# EAGLE design BadgeHighSchoolFirst2 (EAGLE 9.5.0)
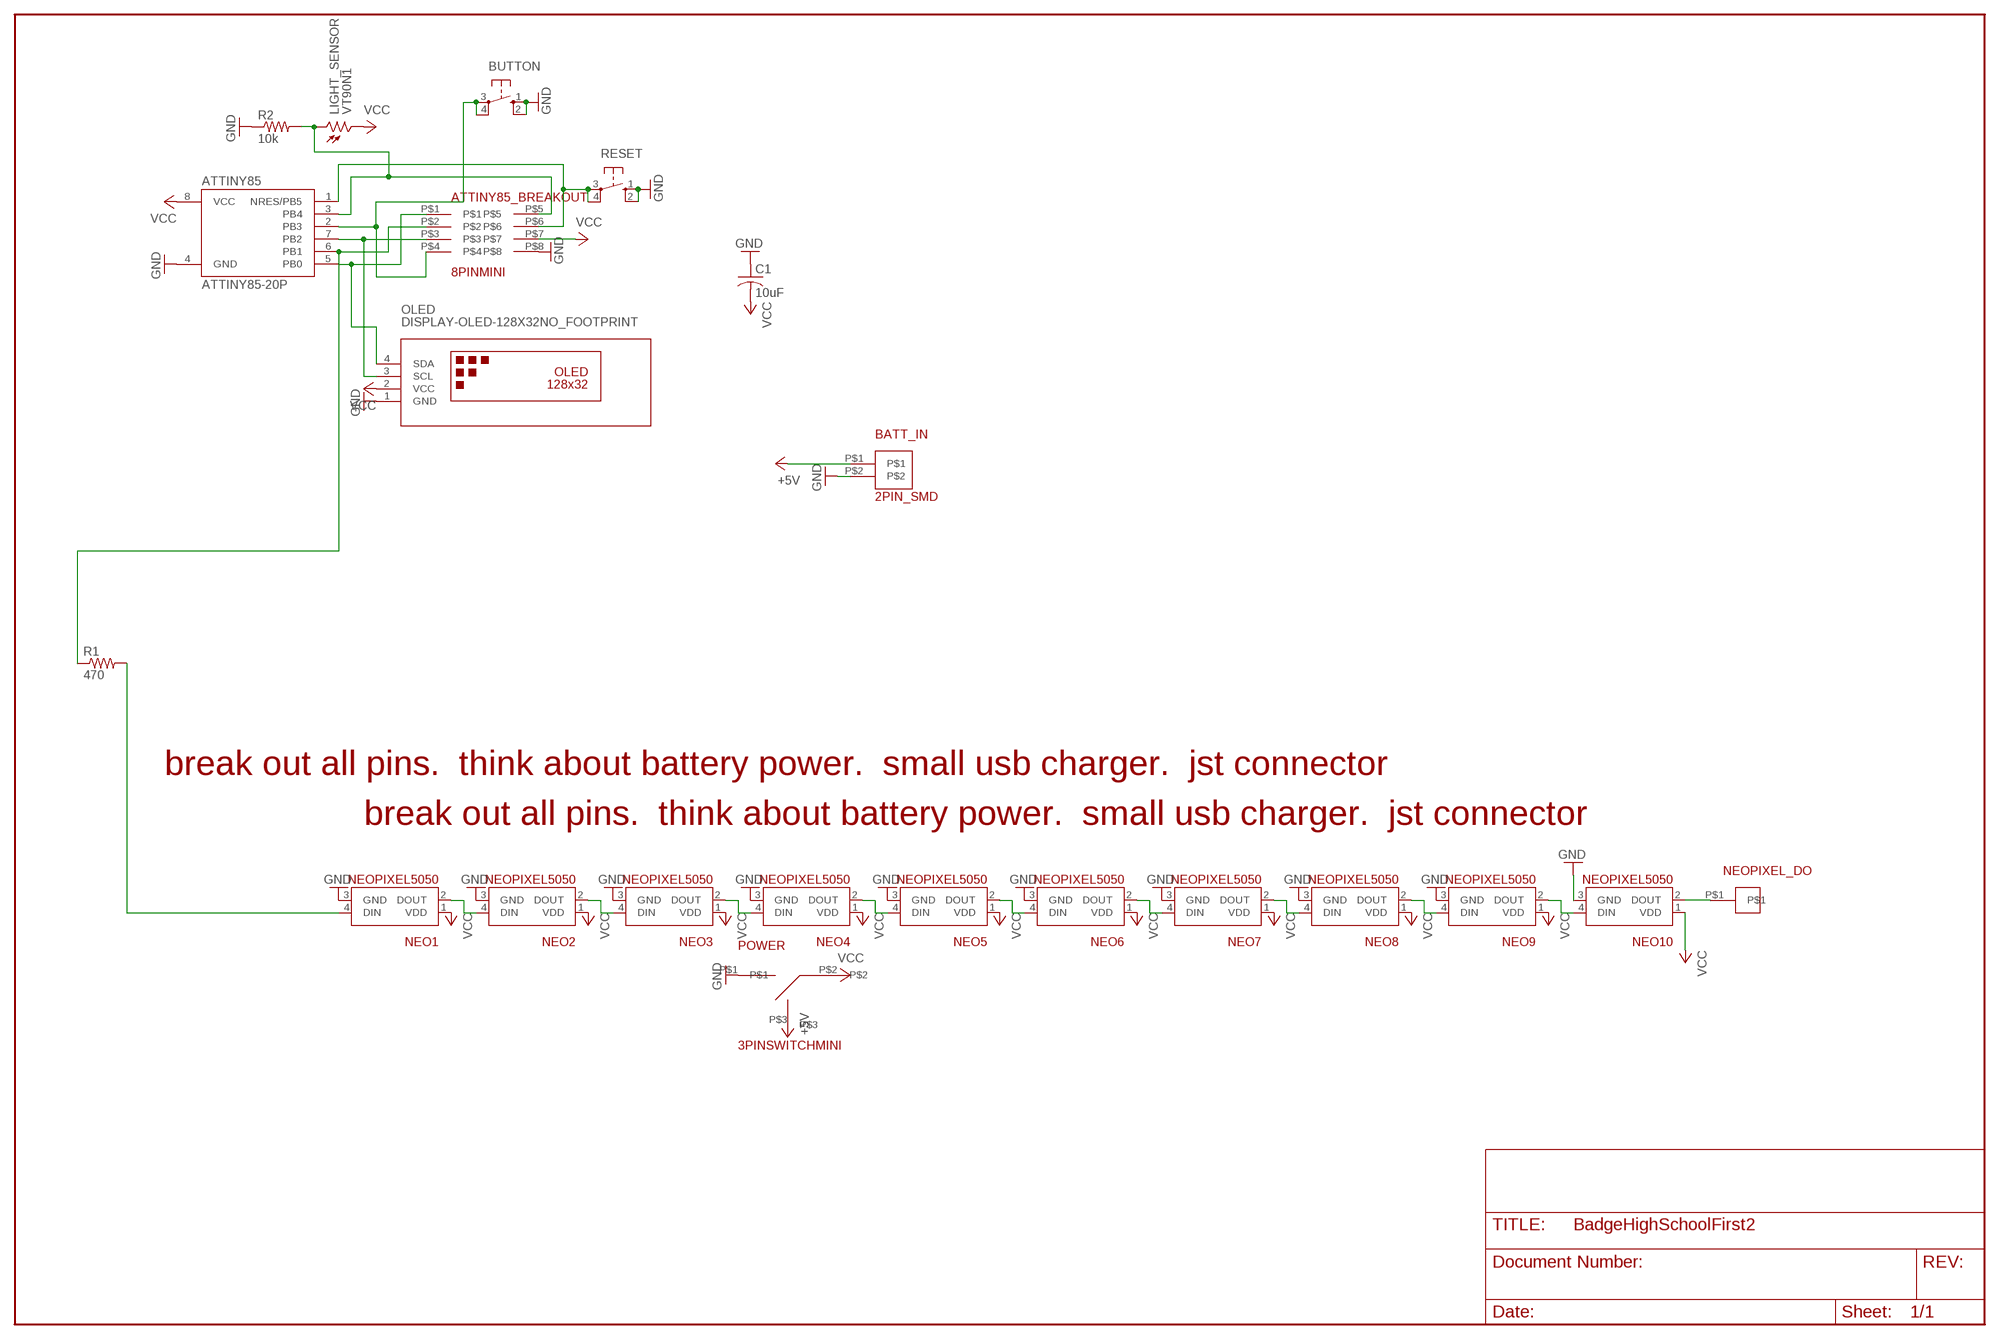
[diagram p0: schematic, sheet 1]

## Parts
ATTINY85  ATTINY85-20P  [PDIP08_300MIL]
ATTINY85_BREAKOUT  8PINMINI  [8PINMINI]
BATT_IN  2PIN_SMD  [2PIN_SMD]
BUTTON  10-XX  [B3F-10XX]
C1  10uF  C-US025-024X044  [C025-024X044]
LIGHT_SENSOR  VT90N1  [VT900]
NEO1  NEOPIXEL5050  [NEOPIXEL5050]
NEO2  NEOPIXEL5050  [NEOPIXEL5050]
NEO3  NEOPIXEL5050  [NEOPIXEL5050]
NEO4  NEOPIXEL5050  [NEOPIXEL5050]
NEO5  NEOPIXEL5050  [NEOPIXEL5050]
NEO6  NEOPIXEL5050  [NEOPIXEL5050]
NEO7  NEOPIXEL5050  [NEOPIXEL5050]
NEO8  NEOPIXEL5050  [NEOPIXEL5050]
NEO9  NEOPIXEL5050  [NEOPIXEL5050]
NEO10  NEOPIXEL5050  [NEOPIXEL5050]
NEOPIXEL_DO  1PINMINI  [1PINMINI]
OLED  DISPLAY-OLED-128X32NO_FOOTPRINT  [DISPLAY-OLED-128X32_NO_FOOTPRINT]
POWER  3PINSWITCHMINI  [3PINMINI]
R1  470  R-US_0204/5  [0204/5]
R2  10k  R-US_0204/5  [0204/5]
RESET  10-XX  [B3F-10XX]

## Nets
+5V [5V]: BATT_IN.P$1 POWER.P$3
GND [5V]: ATTINY85.4(GND) ATTINY85_BREAKOUT.P$8 BATT_IN.P$2 BUTTON.1(S) BUTTON.2(S1) C1.1 NEO1.3(GND) NEO2.3(GND) NEO3.3(GND) NEO4.3(GND) NEO5.3(GND) NEO6.3(GND) NEO7.3(GND) NEO8.3(GND) NEO9.3(GND) NEO10.3(GND) OLED.1(GND) POWER.P$1 R2.1 RESET.1(S) RESET.2(S1)
N$11: ATTINY85.5(PB0) ATTINY85_BREAKOUT.P$1 OLED.4(SDA)
N$12: NEO1.4(DIN) R1.2
N$13: ATTINY85.7(PB2) ATTINY85_BREAKOUT.P$3 OLED.3(SCL)
N$14: ATTINY85.2(PB3) ATTINY85_BREAKOUT.P$4 BUTTON.3(P) BUTTON.4(P1)
N$15: ATTINY85.3(PB4) ATTINY85_BREAKOUT.P$5 LIGHT_SENSOR.1 R2.2
N$16: ATTINY85.1(NRES/PB5) ATTINY85_BREAKOUT.P$6 RESET.3(P) RESET.4(P1)
N$18: NEO1.2(DOUT) NEO2.4(DIN)
N$19: ATTINY85.6(PB1) ATTINY85_BREAKOUT.P$2 R1.1
N$20: NEO2.2(DOUT) NEO3.4(DIN)
N$21: NEO3.2(DOUT) NEO4.4(DIN)
N$22: NEO4.2(DOUT) NEO5.4(DIN)
N$23: NEO5.2(DOUT) NEO6.4(DIN)
N$24: NEO6.2(DOUT) NEO7.4(DIN)
N$25: NEO7.2(DOUT) NEO8.4(DIN)
N$26: NEO8.2(DOUT) NEO9.4(DIN)
N$27: NEO9.2(DOUT) NEO10.4(DIN)
N$28: NEO10.2(DOUT) NEOPIXEL_DO.P$1
VCC [5V]: ATTINY85.8(VCC) ATTINY85_BREAKOUT.P$7 C1.2 LIGHT_SENSOR.2 NEO1.1(VDD) NEO2.1(VDD) NEO3.1(VDD) NEO4.1(VDD) NEO5.1(VDD) NEO6.1(VDD) NEO7.1(VDD) NEO8.1(VDD) NEO9.1(VDD) NEO10.1(VDD) OLED.2(VCC) POWER.P$2

## Notes on the sheet
- break out all pins.  think about battery power.  small usb charger.  jst connector
- break out all pins.  think about battery power.  small usb charger.  jst connector

## Library data of the parts
ATTINY85 = TrophyParts:ATTINY85*: ATMEL ATtiny 85 Packages: P = PDIP 08 30mil S = SOIC 08 EIAJ 208mil Technologies Note: for complete ordering code (temp. range, finish, tape&reel etc.) see www.atmel.com • Supply Voltage: V = (1.8…5.5)V | [blank] = (2.7…5.5)V • Speed: 10 = 10 MHz | 20 = 20 MHz Author: Dipl.-Ing. FH Rainer Bayer HHN Hochschule Heilbronn (Heilbronn University), rainer.bayer@hs-heilbronn.de Ingenieurbüro ing-rb, mail@ing-rb.de
ATTINY85_BREAKOUT = TrophyParts:8PINMINI
BATT_IN = TrophyParts:2PIN_SMD
BUTTON RESET = switch-omron:10-XX: OMRON SWITCH; MPN: B3F-1000; OC_FARNELL: 176432; OC_NEWARK: 36M3542
C1 = adafruit:C-US: CAPACITOR, American symbol
LIGHT_SENSOR = TrophyParts:VT9: Photoconductive Cell VT900 Series Source: http://optoelectronics.perkinelmer.com/content/Datasheets/DTS_vt900seriesdatasheet.pdf
NEO1-NEO10 = TrophyParts:NEOPIXEL5050
NEOPIXEL_DO = TrophyParts:1PINMINI
OLED = TrophyParts:DISPLAY-OLED-128X32: 128x32 Dot Matrix OLED Module with I2C interface based on SSD1306 chip More details available here: http://www.tinyosshop.com/index.php?route=product/product&product_id=953 Schematic available here: http://www.tinyosshop.com/datasheet/OLED%2012832.pdf SSD1306 datasheet: https://cdn-shop.adafruit.com/datasheets/SSD1306.pdf Click here to find device on ebay.com <http://www.ebay.com/sch/oled+display+128x32+i2c>
POWER = TrophyParts:3PINSWITCHMINI
R1 R2 = adafruit:R-US_: RESISTOR, American symbol

## Net classes
2 5V: width 0.508 mm
3 BAT: width 0.508 mm

## Board
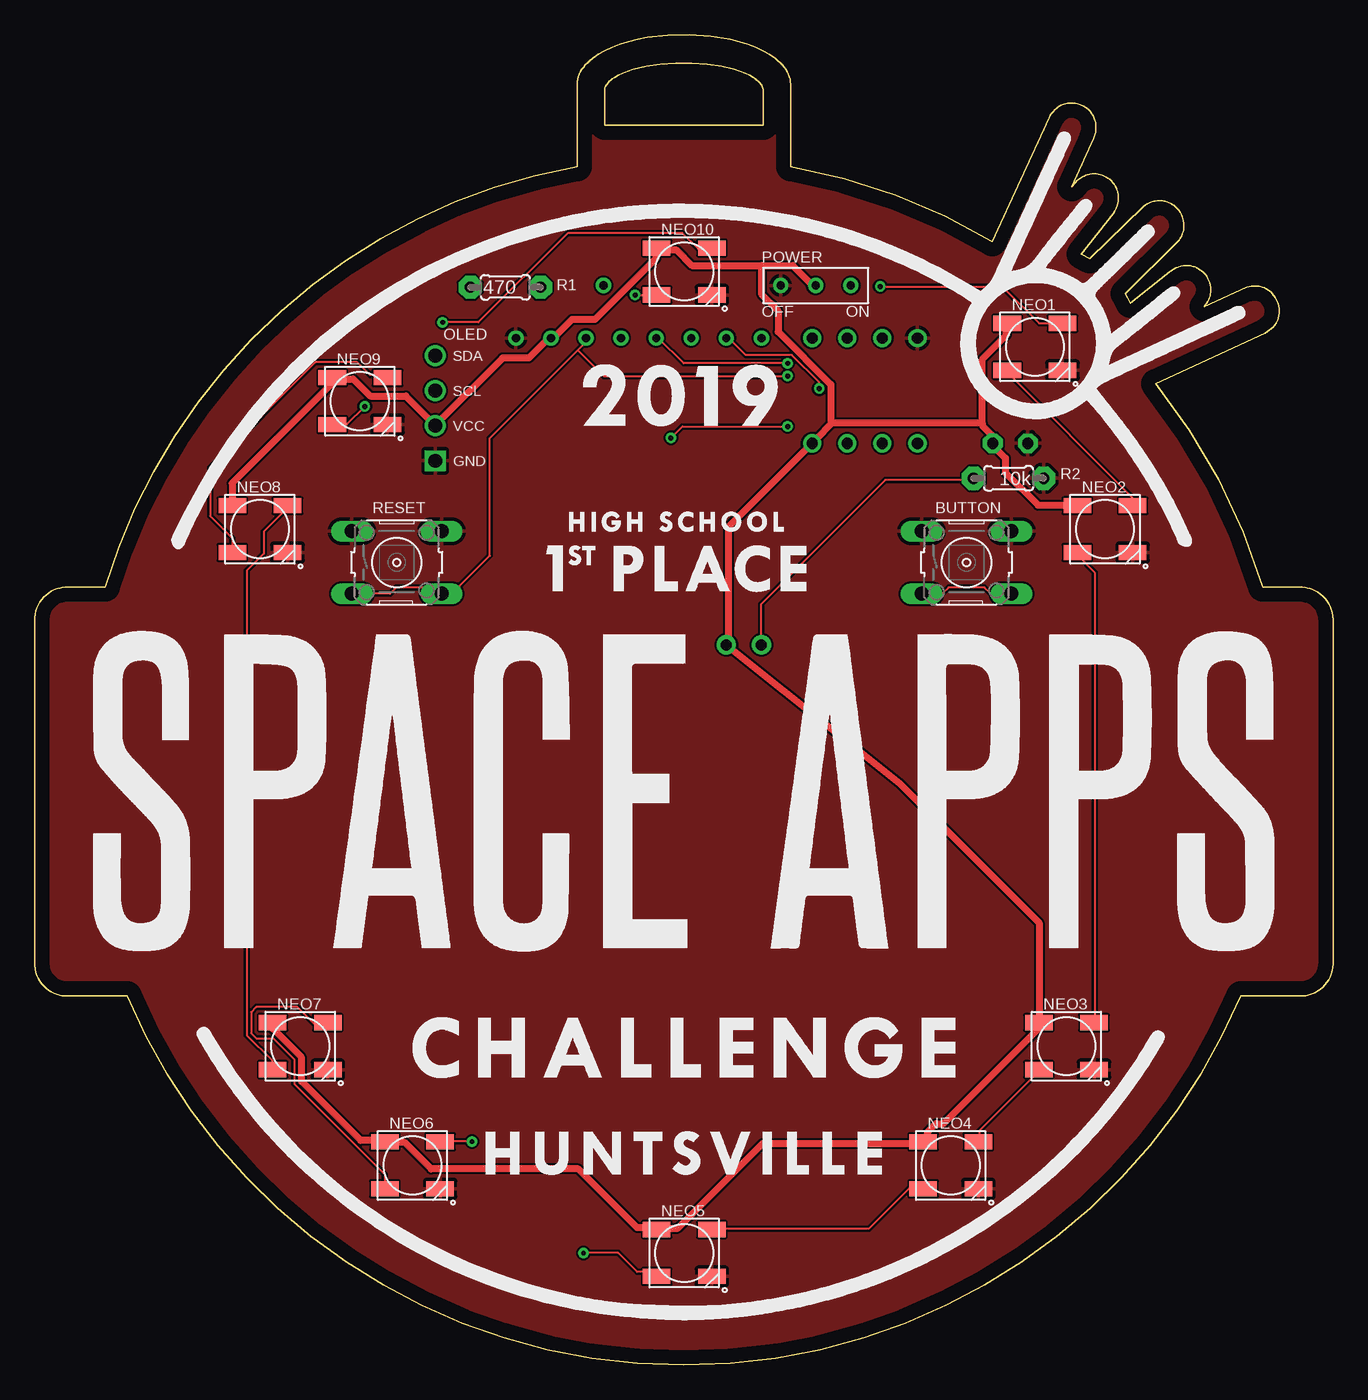
[diagram p1: board, top side]
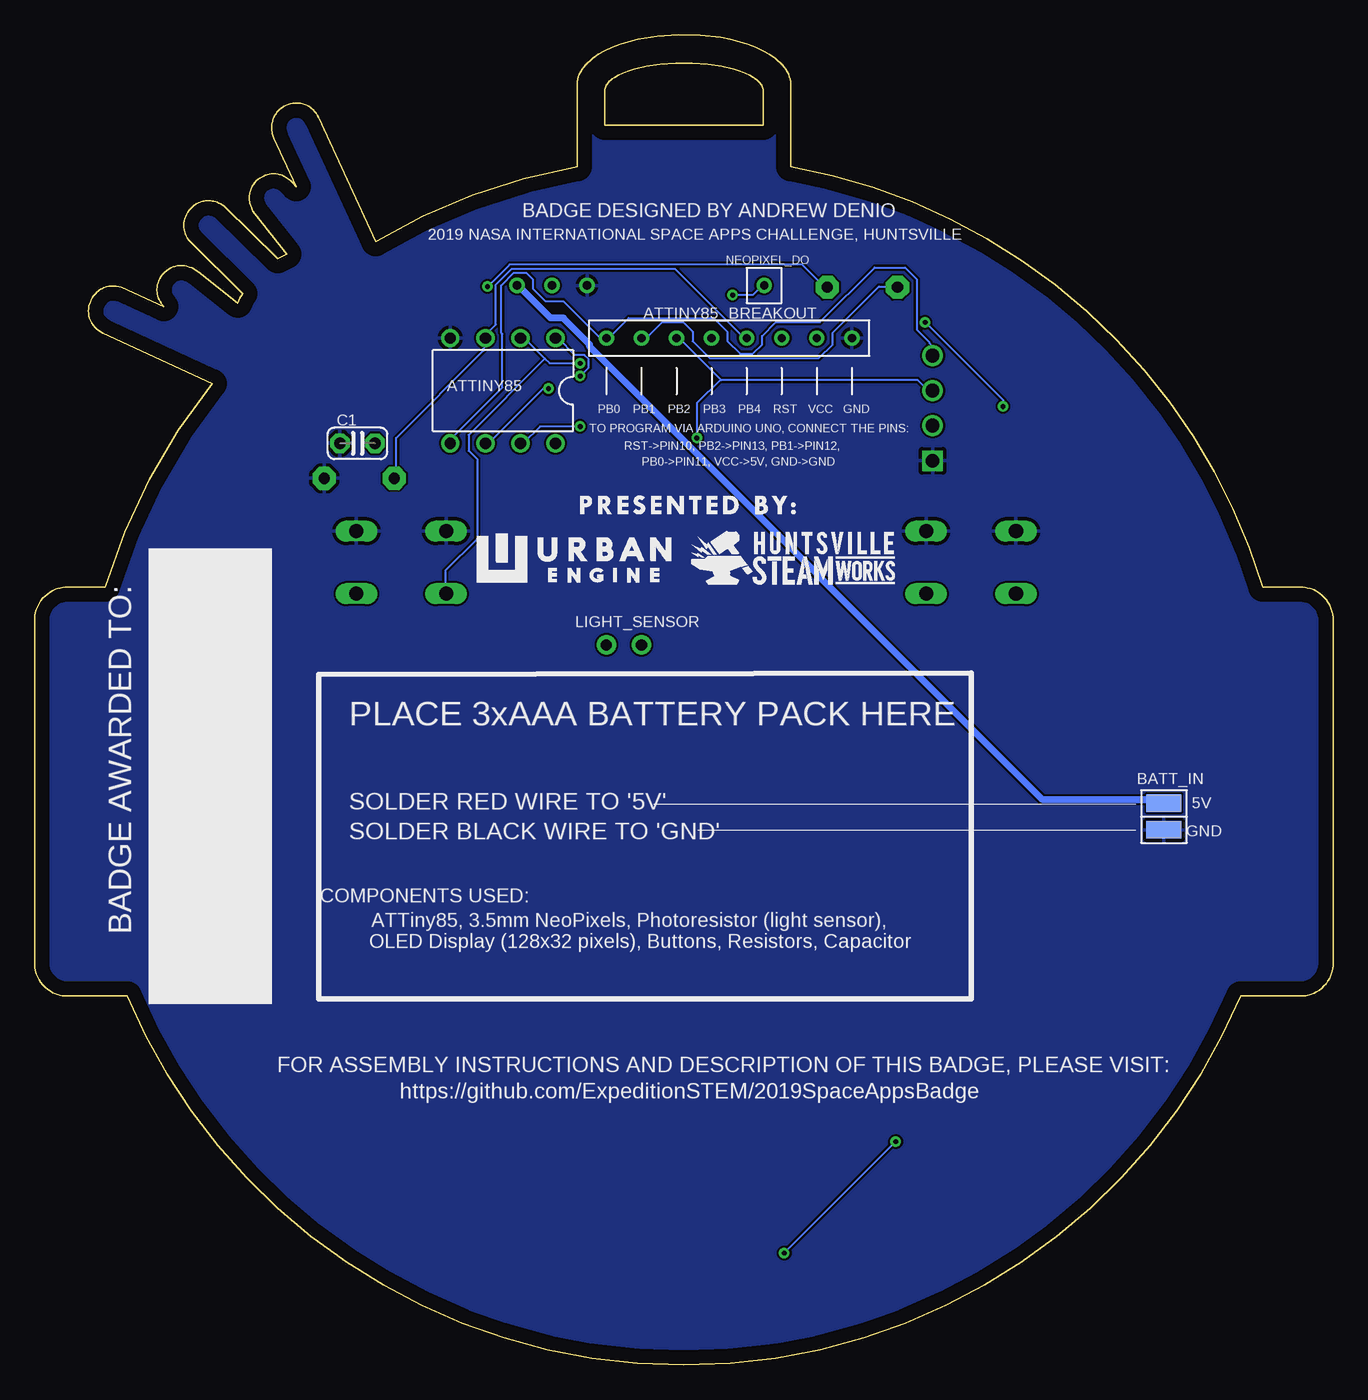
[diagram p2: board, bottom side, seen from below]

Size 94.08 x 96.41 mm. Coordinates in mm from the lower left corner, seen from the top.
Outline: 91.72,56.37 88.95,56.37 87.54,60.35 85.77,64.15 83.65,67.74 81.21,71.09 89.13,74.78 89.3,74.87 89.46,74.97 89.6,75.09 89.72,75.21 89.83,75.35 89.93,75.49 90.01,75.64 90.04,75.71 90.1,75.87 90.14,76.04 90.16,76.2 90.17,76.37 90.16,76.55 90.13,76.72 90.08,76.89 90.02,77.07 89.95,77.21 89.88,77.33 89.81,77.44 89.74,77.54 89.65,77.63 89.57,77.72 89.47,77.8 89.38,77.88 89.27,77.94 89.17,78 89.06,78.05 88.94,78.1 88.83,78.13 88.71,78.16 88.59,78.17 88.46,78.18 88.33,78.18 88.15,78.17 87.97,78.14 87.79,78.09 84.72,76.68 84.82,76.8 84.91,76.93 84.98,77.06 85.05,77.19 85.11,77.32 85.15,77.46 85.18,77.59 85.2,77.74 85.21,77.82 85.21,77.99 85.2,78.08 85.17,78.25 85.13,78.41 85.07,78.57 84.99,78.73 84.89,78.88 84.78,79.03 84.65,79.17 84.5,79.3 84.35,79.41 84.18,79.5 84.1,79.54 84.01,79.58 83.92,79.6 83.83,79.63 83.74,79.65 83.65,79.66 83.55,79.67 83.46,79.67 83.37,79.67 83.2,79.65 83.03,79.62 82.86,79.57 82.69,79.5 82.52,79.41 82.35,79.31 82.18,79.19 79.37,76.93 79.2,77.29 79.01,77.64 82.81,81.38 82.91,81.52 83.01,81.66 83.09,81.81 83.15,81.96 83.2,82.11 83.24,82.27 83.26,82.43 83.26,82.59 83.25,82.75 83.23,82.91 83.19,83.06 83.13,83.22 83.06,83.37 82.97,83.52 82.87,83.67 82.81,83.75 82.74,83.83 82.67,83.9 82.59,83.97 82.51,84.03 82.43,84.08 82.35,84.14 82.26,84.18 82.17,84.23 82.08,84.26 81.98,84.29 81.89,84.32 81.79,84.34 81.69,84.36 81.59,84.36 81.43,84.37 81.31,84.36 81.19,84.34 81.08,84.32 80.96,84.28 80.84,84.24 80.73,84.19 80.61,84.14 80.44,84.03 80.31,83.93 76.45,80.17 75.81,80.49 78.13,83.41 78.25,83.61 78.35,83.81 78.43,84.01 78.48,84.2 78.5,84.3 78.51,84.39 78.52,84.49 78.52,84.58 78.51,84.76 78.5,84.84 78.48,84.93 78.46,85.01 78.41,85.18 78.38,85.25 78.3,85.41 78.21,85.55 78.11,85.68 78,85.8 77.88,85.91 77.75,86 77.62,86.09 77.49,86.16 77.35,86.21 77.21,86.26 77.06,86.29 76.92,86.31 76.77,86.32 76.61,86.31 76.43,86.28 76.34,86.26 76.24,86.23 76.14,86.2 76.04,86.16 75.94,86.1 75.83,86.04 75.73,85.97 75.62,85.89 75.51,85.8 75.4,85.7 75.3,85.59 75.19,85.46 75.19,85.46 75.12,85.38 76.74,88.9 76.81,89.12 76.84,89.23 76.86,89.35 76.88,89.46 76.88,89.57 76.89,89.68 76.88,89.79 76.87,89.9 76.86,90.01 76.84,90.11 76.81,90.22 76.77,90.32 76.73,90.42 76.68,90.52 76.63,90.6 76.58,90.69 76.52,90.77 76.46,90.84 76.39,90.91 76.32,90.98 76.25,91.04 76.17,91.1 76.09,91.16 76.01,91.21 75.92,91.25 75.83,91.3 75.74,91.33 75.64,91.36 75.55,91.39 75.38,91.42 75.21,91.44 75.12,91.44 75,91.44 74.9,91.43 74.79,91.41 74.68,91.39 74.57,91.36 74.46,91.32 74.34,91.27 74.23,91.21 74.12,91.13 74,91.05 73.89,90.95 73.79,90.83 73.68,90.7 73.58,90.56 73.49,90.39 69.36,81.4 65.95,83.23 62.37,84.76 58.64,85.96 54.76,86.84 54.76,92.81 54.75,92.99 54.73,93.17 54.68,93.36 54.61,93.53 54.52,93.71 54.42,93.88 54.3,94.05 54.16,94.21 54,94.37 53.83,94.53 53.65,94.68 53.23,94.96 52.76,95.23 52.23,95.48 51.66,95.7 51.04,95.89 50.39,96.06 48.97,96.3 47.43,96.41 45.86,96.37 44.38,96.2 43.68,96.06 43.02,95.89 42.41,95.7 41.84,95.48 41.31,95.23 40.84,94.96 40.42,94.68 40.23,94.53 40.06,94.37 39.91,94.21 39.77,94.05 39.65,93.88 39.55,93.71 39.46,93.53 39.39,93.36 39.34,93.17 39.31,92.99 39.3,92.81 39.3,86.83 36.28,86.18 33.34,85.33 30.49,84.28 27.74,83.04 25.09,81.62 22.56,80.03 20.14,78.28 17.86,76.36 15.71,74.3 13.7,72.1 11.84,69.77 10.15,67.31 8.62,64.73 7.27,62.04 6.1,59.25 5.12,56.37 2.22,56.36 1.98,56.34 1.87,56.32 1.64,56.26 1.43,56.17 1.22,56.07 1.03,55.95 0.85,55.8 0.68,55.64 0.53,55.47 0.39,55.28 0.27,55.08 0.17,54.86 0.09,54.64 0.04,54.4 0,54.15 0,28.94 0.04,28.7 0.09,28.46 0.17,28.24 0.27,28.02 0.39,27.82 0.53,27.63 0.68,27.46 0.85,27.3 1.03,27.15 1.22,27.03 1.43,26.93 1.53,26.88 1.75,26.81 1.87,26.78 1.98,26.76 2.22,26.74 6.71,26.73 8.06,23.84 9.61,21.07 11.35,18.43 13.27,15.93 15.36,13.57 17.61,11.37 20.02,9.34 22.57,7.48 25.25,5.8 28.06,4.32 30.99,3.04 34.02,1.97 37.15,1.12 40.37,0.5 43.67,0.13 47.04,0 50.41,0.13 53.7,0.5 56.92,1.12 60.05,1.97 63.09,3.04 66.01,4.32 68.82,5.8 71.51,7.48 74.06,9.34 76.47,11.37 78.72,13.57 80.81,15.93 82.73,18.43 84.47,21.07 86.02,23.84 87.36,26.73 91.84,26.74 92.08,26.76 92.2,26.78 92.31,26.81 92.53,26.88 92.74,26.98 92.94,27.09 93.13,27.22 93.31,27.37 93.47,27.54 93.61,27.72 93.74,27.92 93.85,28.13 93.94,28.35 94,28.58 94.05,28.82 94.08,29.07 94.08,54.03 94.05,54.28 94,54.52 93.94,54.75 93.85,54.97 93.74,55.18 93.61,55.38 93.47,55.56 93.31,55.73 93.13,55.88 92.94,56.01 92.74,56.12 92.53,56.22 92.42,56.26 92.2,56.32 92.08,56.34 91.84,56.36 91.72,56.37
Outline: 41.29,92.31 41.29,92.42 41.32,92.52 41.35,92.62 41.4,92.72 41.47,92.82 41.55,92.92 41.64,93.01 41.74,93.1 41.85,93.19 41.98,93.28 42.27,93.45 42.6,93.61 42.97,93.75 43.38,93.88 44.29,94.1 45.32,94.25 46.45,94.34 47.62,94.34 48.74,94.25 49.77,94.1 50.69,93.88 51.1,93.75 51.47,93.61 51.8,93.45 52.09,93.28 52.21,93.19 52.33,93.1 52.43,93.01 52.52,92.92 52.6,92.82 52.66,92.72 52.71,92.62 52.75,92.52 52.77,92.42 52.78,92.31 52.78,89.85 41.29,89.85 41.29,92.31
Copper layers (1*16): Top 0.035mm / dielectric 1.5mm / Bottom 0.035mm
Design rules "default *": minimum track width 6mil, minimum drill 0.35mm, track to track 6mil, track to pad 6mil, pad to pad 6mil, via to via 6mil, smd to smd 6mil, copper to edge 40mil, drill to drill 6mil, minimum pad ring 10mil, minimum via ring 8mil, stop-mask expansion 4mil, vias tented up to drill 15mil, thermal gap 10mil
vRestrict: area 27.4,20.4 to 67.4,25.6; area 32.1,13.1 to 61.8,17.4; area 39.4,67.6 to 54.2,72.8; area 9.5,57.8 to 91.8,94.3; area 11.1,2.8 to 82.5,25.3; area 40.2,3.9 to 55.1,18.3; area 37.4,57.4 to 56.6,62.2; area 28.6,56.9 to 64.5,61.5; area 38.4,62.2 to 54.9,64.3; area 3.2,29.6 to 11.6,53.5; area 13.5,29.7 to 21.4,53.5; area 21.3,29.8 to 30.6,53.2; area 31.7,30.1 to 39.2,53.3; area 40.8,29.7 to 47.6,53.3; area 52.9,29.8 to 62,53.3; area 63.6,29.6 to 71.8,53.2; area 73.2,30.3 to 81.1,53.5; area 82.4,29.7 to 90,53.5

### Footprints (pad centres in the part's own frame; a part is rotated, then mirrored left to right if it is on the bottom)
PDIP08_300MIL = drill 0.813: 1 -3.81,-3.81; 2 -1.27,-3.81; 3 1.27,-3.81; 4 3.81,-3.81; 5 3.81,3.81; 6 1.27,3.81; 7 -1.27,3.81; 8 -3.81,3.81
8PINMINI = drill 0.6: P$1 0,2.54; P$2 2.54,2.54; P$3 5.08,2.54; P$4 7.62,2.54; P$5 10.16,2.54; P$6 12.7,2.54; P$7 15.24,2.54; P$8 17.78,2.54
2PIN_SMD = smd 2.54 x 1.27: P$1 0,2; P$2 0,0.048
B3F-10XX = drill 1.016 long: 1 -3.251,2.261; 2 3.251,2.261; 3 -3.251,-2.261; 4 3.251,-2.261
C025-024X044 = drill 0.813 pad 1.422 octagon: 1 -1.27,0; 2 1.27,0
VT900 = drill 0.8 pad 1.4: 1 -1.27,0; 2 1.27,0
NEOPIXEL5050 = smd 2 x 1.1: 1 -2,1.7; 2 -2,-1.7; 3 2,-1.7; 4 2,1.7
1PINMINI = drill 0.6: P$1 0,0
DISPLAY-OLED-128X32_NO_FOOTPRINT = drill 1 square: 1 -17.78,-3.81 | drill 1: 2 -17.78,-1.27; 3 -17.78,1.27; 4 -17.78,3.81
3PINMINI = drill 0.6: P$1 1.27,3.81; P$2 3.81,3.81; P$3 6.35,3.81
0204/5 = drill 0.813 pad 1.676 octagon: 1 -2.54,0; 2 2.54,0

### Placement (x,y rotation side)
ATTINY85  60.14,70.6 180 bottom
ATTINY85_BREAKOUT  52.65,71.87 0 bottom
BATT_IN  12.26,38.72 0 bottom
BUTTON  67.51,58.15 0 top
C1  70.68,66.79 0 bottom
LIGHT_SENSOR  51.38,52.19 0 bottom
NEO1  72.46,73.78 0 top
NEO2  77.54,60.57 0 top
NEO3  74.75,23.1 0 top
NEO4  66.37,14.47 0 top
NEO5  47.06,8.12 0 top
NEO6  27.38,14.47 0 top
NEO7  19.25,23.1 0 top
NEO8  16.33,60.57 0 top
NEO9  23.57,69.84 0 top
NEO10  47.06,79.24 0 top
NEOPIXEL_DO  41.22,78.22 0 bottom
OLED  46.81,69.33 0 top
POWER  52.78,74.41 0 top
R1  34.11,78.09 0 top
R2  70.56,64.25 180 top
RESET  26.23,58.15 0 top

### Tracks (layer width: path | path; a pad name or v marks a point on that pad's centre or on a via)
+5V
  Bottom 0.508: POWER.P$3 58.97,78.07 58.9,78.07 56.69,75.86 55.77,75.86 53.87,73.95 53.87,73.8 21.03,40.96 12.49,40.96 BATT_IN.P$1
GND
  pour Top: -7.93,98.03 -7.93,3.29 0.58,-5.22 96.97,-5.22 101.67,-0.52 101.67,100.06 100.78,100.95 -5.01,100.95
  pour Bottom: -9.58,100.83 -9.58,0.37 0.71,-9.92 97.86,-9.92 105.35,-2.42 107.01,-0.77 107.01,105.27 -5.14,105.27
N$11
  Bottom 0.152: ATTINY85.5 63.93,66.79 63.93,67.1 60.19,70.83 60.19,74.72 60.27,74.79 60.27,78.22 59.36,79.13 58.44,79.13 57.98,78.68 57.98,77.99 57.07,77.08 55.77,77.08 53.11,74.41 ATTINY85_BREAKOUT.P$1 52.5,74.41 51.05,75.86 44.88,75.86 43.89,74.87 43.89,74.18 42.97,73.27 42.06,73.27 41.37,73.95 41.37,74.56 40.38,75.55 37.18,75.55 33.22,79.52 31.01,79.52 30.17,78.68 30.17,75.02 29.26,74.11 29.26,74.03 29.03,73.8 OLED.4
N$12  (via drill 0.35)
  Top 0.152: v61.26,78.14 70.1,78.14 72.77,75.48 74.44,75.48 NEO1.4
  Bottom 0.152: v61.26,78.14 59.66,79.74 38.48,79.74 36.88,78.14 36.65,78.14 R1.2
N$13  (via drill 0.35)
  Top 0.152: v54.55,68.01 46.93,68.01 v46.1,67.17
  Bottom 0.152: ATTINY85_BREAKOUT.P$3 47.39,74.41 44.38,71.4 | 44.38,71.4 44.34,71.36 30.09,71.36 29.33,70.6 OLED.3 | ATTINY85.7 58.67,66.79 57.45,68.01 v54.55,68.01 | v46.1,67.17 46.1,69.69 44.38,71.4
N$14  (via drill 0.35)
  Top 0.152: BUTTON.3 65.76,55.89 66.21,56.35 68.8,56.35 69.26,55.89 BUTTON.4 | ATTINY85_BREAKOUT.P$4 45.18,74.41 47.01,72.58 v54.55,72.58
  Bottom 0.152: v54.55,72.58 56.76,72.58 57.11,72.92 | 57.11,72.92 58.59,74.41 ATTINY85.2 | 57.11,72.92 62.63,67.4 62.63,66.26 62.02,65.65 62.02,59.86 64.31,57.57 64.31,55.89 BUTTON.3
N$15
  Top 0.152: LIGHT_SENSOR.1 52.65,55.16 61.62,64.12 67.89,64.12 R2.2
  Bottom 0.152: ATTINY85_BREAKOUT.P$5 42.67,74.41 47.7,79.44 59.51,79.44 60.65,78.3 60.65,75.4 61.11,74.94 61.11,74.72 ATTINY85.3 61.41,73.8 61.56,73.65 61.56,73.5 67.89,67.17 67.89,64.35 67.97,64.28 R2.2
N$16  (via drill 0.35)
  Top 0.152: 39.35,73.53 32.99,67.17 32.99,58.64 30.78,56.43 30.78,55.89 RESET.4 29.26,55.89 28.8,56.35 26.21,56.35 25.75,55.89 RESET.3 | 39.35,73.53 39.92,74.11 39.92,74.41 ATTINY85_BREAKOUT.P$6 | v54.55,71.67 41.22,71.67 39.35,73.53
  Bottom 0.152: ATTINY85.1 56.15,74.41 54.94,73.19 54.25,73.19 53.94,72.89 53.94,72.28 v54.55,71.67
N$18
  Top 0.152: NEO2.4 79.47,62.29 79.47,62.9 70.48,71.9 70.48,72.05 NEO1.2
N$19  (via drill 0.35)
  Top 0.152: ATTINY85_BREAKOUT.P$2 50.29,74.41 51.51,73.19 54.86,73.19 56.84,71.21 v56.84,70.75
  Bottom 0.152: v56.84,70.75 57.22,70.75 60.88,67.1 61.11,67.1 ATTINY85.6 | ATTINY85_BREAKOUT.P$2 49.75,74.41 48.61,75.55 47.09,75.55 46.4,74.87 46.4,74.18 45.18,72.96 37.26,72.96 36.27,73.95 36.27,74.79 32.91,78.14 31.62,78.14 R1.1
N$20
  Top 0.152: NEO3.4 76.8,24.8 76.8,57.42 75.59,58.64 75.59,58.87 NEO2.2
N$21
  Top 0.152: NEO4.4 68.42,16.19 68.42,16.96 72.69,21.22 72.69,21.38 NEO3.2
N$22
  Top 0.152: NEO5.4 49.07,9.87 60.42,9.87 63.39,12.84 64.31,12.84 NEO4.2
N$23  (via drill 0.35)
  Top 0.152: v31.69,16.19 29.41,16.19 NEO6.4 | v39.77,8.12 42.29,8.12 43.66,6.74 44.72,6.74 45.03,6.44 NEO5.2
  Bottom 0.152: v39.77,8.12 v31.69,16.19
N$24
  Top 0.152: NEO6.2 25.37,12.84 25.37,13.83 18.82,20.38 18.82,22.14 17.29,23.66 16.07,23.66 15.69,24.04 15.69,25.57 16.07,25.95 19.05,25.95 20.26,24.73 21.18,24.73 NEO7.4
N$25
  Top 0.152: NEO7.2 17.22,21.45 17.22,22.06 15.39,23.89 15.39,57.57 16.61,58.79 16.61,60.39 18.28,62.07 18.28,62.22 NEO8.4
N$26
  Top 0.152: NEO8.2 14.32,58.94 14.32,59.93 12.72,61.53 12.72,65.04 20.34,72.66 23.39,72.66 24.3,71.74 25.37,71.74 25.52,71.59 NEO9.4
N$27  (via drill 0.35)
  Top 0.152: v23.92,69.46 22.63,68.16 21.64,68.16 NEO9.2 | v29.56,75.55 32.15,75.55 38.63,82.03 46.93,82.03 48.08,80.89 48.99,80.89 NEO10.4
  Bottom 0.152: v23.92,69.46 23.92,69.91 v29.56,75.55
N$28  (via drill 0.35)
  Top 0.152: v43.51,77.53 45.03,77.53 NEO10.2
  Bottom 0.152: v43.51,77.53 42.06,77.53 41.37,78.22 NEOPIXEL_DO.P$1
VCC
  Top 0.508: NEO7.1 17.29,24.73 17.29,24.35 19.35,22.29 19.35,20.54 23.62,16.27 25.29,16.27 25.37,16.19 NEO6.1 25.6,16.12 26.82,16.12 28.72,14.21 39.39,14.21 43.66,9.95 44.88,9.95 NEO5.1 45.11,9.87 46.55,9.87 52.73,16.04 64.23,16.04 64.31,16.12 NEO4.1 64.54,16.35 64.69,16.5 64.69,16.88 65.3,17.49 65.83,17.49 72.69,24.35 72.69,24.73 NEO3.1 72.77,25.03 72.77,32.04 62.68,42.13 LIGHT_SENSOR.2 50.24,52.31 50.24,60.72 56.15,66.64 ATTINY85.8 56.38,66.79 56.61,67.02 56.61,67.1 57.75,68.24 | NEO2.1 75.51,62.29 72.69,62.29 70.33,64.66 70.33,65.72 69.41,66.64 C1.2 69.34,67.02 69.34,67.4 68.65,68.09 68.65,68.24 | 68.65,68.24 68.65,72.89 70.4,74.64 70.4,75.4 NEO1.1 | 68.65,68.24 57.75,68.24 | NEO8.1 14.32,62.29 14.32,63.89 21.64,71.21 21.64,71.51 NEO9.1 21.86,71.44 23.08,71.44 24.3,70.22 26.89,70.22 29.03,68.09 OLED.2 29.18,68.24 33.9,72.96 35.81,72.96 37.1,74.26 37.26,74.26 ATTINY85_BREAKOUT.P$7 37.56,74.41 38.93,75.78 40.61,75.78 45.03,80.2 45.03,80.89 NEO10.1 45.26,80.81 46.48,80.81 47.62,79.67 52.65,79.67 | POWER.P$2 56.38,78.22 54.94,79.67 52.65,79.67 | 52.65,79.67 52.65,77.61 53.87,76.39 53.87,74.87 57.68,71.06 57.68,68.47 57.75,68.24

### Text on the board
tPlace: OFF | ON
bPlace: BADGE DESIGNED BY ANDREW DENIO | 2019 NASA INTERNATIONAL SPACE APPS CHALLENGE, HUNTSVILLE | GND | VCC | RST | PB4 | PB3 | PB2 | PB1 | PB0 | TO PROGRAM VIA ARDUINO UNO, CONNECT THE PINS: | RST->PIN10, PB2->PIN13, PB1->PIN12, | PB0->PIN11, VCC->5V, GND->GND | PLACE 3xAAA BATTERY PACK HERE | 5V | SOLDER RED WIRE TO '5V' | GND | SOLDER BLACK WIRE TO 'GND' | COMPONENTS USED: | ATTiny85, 3.5mm NeoPixels, Photoresistor (light sensor), | OLED Display (128x32 pixels), Buttons, Resistors, Capacitor | BADGE AWARDED TO: | FOR ASSEMBLY INSTRUCTIONS AND DESCRIPTION OF THIS BADGE, PLEASE VISIT: | https://github.com/ExpeditionSTEM/2019SpaceAppsBadge